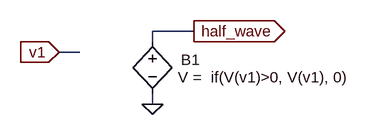
[diagram p0: schematic half_module.asc]
half_module.asc, the LTspice schematic file:
Version 4
SHEET 1 880 680
WIRE 240 160 176 160
WIRE 176 176 176 160
WIRE 64 192 32 192
WIRE 176 272 176 256
FLAG 32 192 v1
IOPIN 32 192 In
FLAG 176 272 0
FLAG 240 160 half_wave
IOPIN 240 160 Out
SYMBOL bv 176 160 R0
WINDOW 0 44 44 Left 0
WINDOW 3 39 71 Left 0
SYMATTR InstName B1
SYMATTR Value V =  if(V(v1)>0, V(v1), 0)

The netlist it stands for:
* half_module.asc
B1 half_wave 0 V =  if(V(v1)>0, V(v1), 0)
.backanno
.end